# EAGLE design maxTouch-EXT V1 (EAGLE 9.5.2)
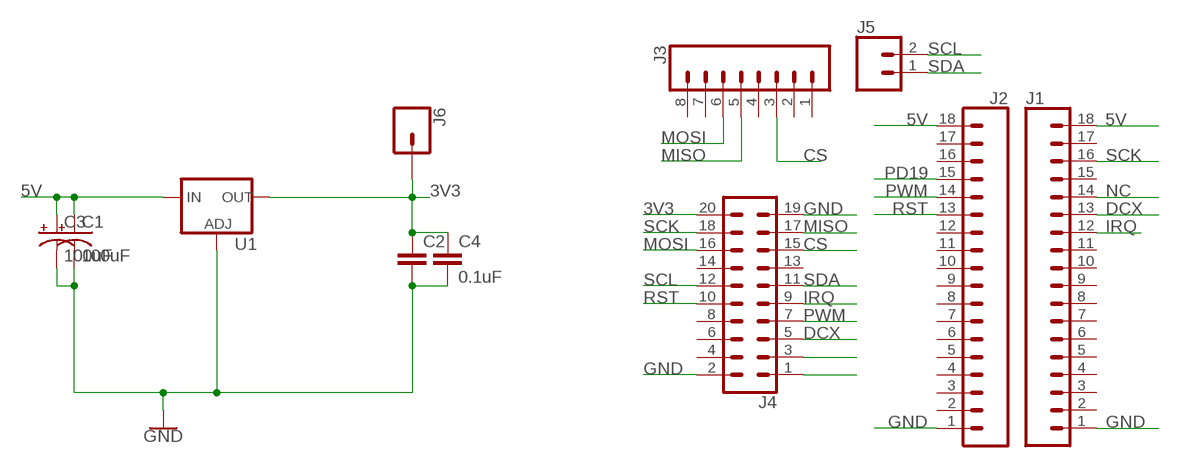
[diagram p0: schematic, sheet 1]

## Parts
C1  100uF  100UF-POLAR-10X10.5-63V-20%  [NIC_10X10.5_CAP]
C2  10uF  CAP-0805  [0805]
C3  100uF  100UF-POLAR-RADIAL-2.5MM-25V-20%  [CPOL-RADIAL-2.5MM-6.5MM]
C4  0.1uF  0.1UF-KIT-EZ-50V-20%  [CAP-PTH-SMALL-KIT]
J1  CONN_18SILK  [1X18]
J2  CONN_18SILK  [1X18]
J3  CONN_08"  [1X08]
J4  CONN_10X2  [2X10]
J5  CONN_02  [1X02]
J6  CONN_01  [1X01]
U1  V_REG_LM1117SOT223  [SOT223]

## Nets
3V3: C2.1 C4.1 J4.20 J6.1 U1.2(OUT) U1.4(OUT)
5V: C1.+ C3.1(+) J1.18 J2.18 U1.3(IN)
CS: J3.3 J4.15
DCX: J1.13 J4.5
GND: C1.- C2.2 C3.2(-) C4.2 J1.1 J2.1 J4.2 J4.19 U1.1(ADJ)
IRQ: J1.12 J4.9
MISO: J3.5 J4.17
MOSI: J3.6 J4.16
N$13: J4.1
N$14: J4.3
NC: J1.14
PD19: J2.15
PWM: J2.14 J4.7
RST: J2.13 J4.10
SCK: J1.16 J4.18
SCL: J4.12 J5.2
SDA: J4.11 J5.1
Unconnected: J1.2 J1.3 J1.4 J1.5 J1.6 J1.7 J1.8 J1.9 J1.10 J1.11 J1.15 J1.17 J2.2 J2.3 J2.4 J2.5 J2.6 J2.7 J2.8 J2.9 J2.10 J2.11 J2.12 J2.16 J2.17 J3.1 J3.2 J3.4 J3.7 J3.8 J4.4 J4.6 J4.8 J4.13 J4.14

## Library data of the parts
C1 = SparkFun-Capacitors:100UF-POLAR: 100µF polarized capacitors A capacitor is a passive two-terminal electrical component used to store electrical energy temporarily in an electric field.; PROD_ID: CAP-08362
C2 = SparkFun-Capacitors:CAP
C3 = SparkFun-Capacitors:100UF-POLAR: 100µF polarized capacitors A capacitor is a passive two-terminal electrical component used to store electrical energy temporarily in an electric field.; PROD_ID: CAP-08439
C4 = SparkFun-Capacitors:0.1UF: 0.1µF ceramic capacitors A capacitor is a passive two-terminal electrical component used to store electrical energy temporarily in an electric field.; PROD_ID: CAP-08370
J1 J2 = SparkFun-Connectors:CONN_18: Multi connection point. Often used as Generic Header-pin footprint for 0.1 inch spaced/style header connections On any of the 0.1 inch spaced packages, you can populate with these: Break Away Headers - Straight <https://www.sparkfun.com/products/116> (PRT-00116) Break Away Male Headers - Right Angle <https://www.sparkfun.com/products/553> (PRT-00553) Female Headers <https://www.sparkfun.com/products/115> (PRT-00115) Break Away Headers - Machine Pin <https://www.sparkfun.com/products/117> (PRT-00117) Break Away Female Headers - Swiss Machine Pin <https://www.sparkfun.com/products/743> (PRT-00743) For SCREWTERMINALS and SPRING TERMINALS visit here: Screw Terimnals on SparkFun.com <https://www.sparkfun.com/search/results?term=Screw+Terminals> (5mm/3.5mm/2.54mm spacing) This device is also useful as a general connection point to wire up your design to another part of your project. Our various solder wires solder well into these plated through hole pads. Hook-Up Wire - Assortment (Stranded, 22 AWG) <https://www.sparkfun.com/products/11375> (PRT-11375) Hook-Up Wire - Assortment (Solid Core, 22 AWG) <https://www.sparkfun.com/products/11367> (PRT-11367) View the entire wire category on our website here <https://www.sparkfun.com/categories/141> Special notes: Molex polarized connector foot print use with SKU : PRT-08231 with associated crimp pins and housings. 1MM SMD Version SKU: PRT-10208 NOTES ON THE VARIANTS LOCK and LOCK_LONGPADS... This footprint was designed to help hold the alignment of a through-hole component (i.e. 6-pin header) while soldering it into place. You may notice that each hole has been shifted either up or down by 0.005 of an inch from it's more standard position (which is a perfectly straight line). This slight alteration caused the pins (the squares in the middle) to touch the edges of the holes. Because they are alternating, it causes a "brace" to hold the component in place. 0.005 has proven to be the perfect amount of "off-center" position when using our standard breakaway headers. Although looks a little odd when you look at the bare footprint, once you have a header in there, the alteration is very hard to notice. Also,if you push a header all the way into place, it is covered up entirely on the bottom side.
J3 = SparkFun-Connectors:CONN_08: Multi connection point. Often used as Generic Header-pin footprint for 0.1 inch spaced/style header connections On any of the 0.1 inch spaced packages, you can populate with these: Break Away Headers - Straight <https://www.sparkfun.com/products/116> (PRT-00116) Break Away Male Headers - Right Angle <https://www.sparkfun.com/products/553> (PRT-00553) Female Headers <https://www.sparkfun.com/products/115> (PRT-00115) Break Away Headers - Machine Pin <https://www.sparkfun.com/products/117> (PRT-00117) Break Away Female Headers - Swiss Machine Pin <https://www.sparkfun.com/products/743> (PRT-00743) Arduino Stackable Header - 8 Pin <https://www.sparkfun.com/products/9279> (PRT-09279) For SCREWTERMINALS and SPRING TERMINALS visit here: Screw Terimnals on SparkFun.com <https://www.sparkfun.com/search/results?term=Screw+Terminals> (5mm/3.5mm/2.54mm spacing) This device is also useful as a general connection point to wire up your design to another part of your project. Our various solder wires solder well into these plated through hole pads. Hook-Up Wire - Assortment (Stranded, 22 AWG) <https://www.sparkfun.com/products/11375> (PRT-11375) Hook-Up Wire - Assortment (Solid Core, 22 AWG) <https://www.sparkfun.com/products/11367> (PRT-11367) View the entire wire category on our website here <https://www.sparkfun.com/categories/141> Special notes: Molex polarized connector foot print use with SKU : PRT-08231 with associated crimp pins and housings. 1MM SMD Version SKU: PRT-10208 NOTES ON THE VARIANTS LOCK and LOCK_LONGPADS... This footprint was designed to help hold the alignment of a through-hole component (i.e. 6-pin header) while soldering it into place. You may notice that each hole has been shifted either up or down by 0.005 of an inch from it's more standard position (which is a perfectly straight line). This slight alteration caused the pins (the squares in the middle) to touch the edges of the holes. Because they are alternating, it causes a "brace" to hold the component in place. 0.005 has proven to be the perfect amount of "off-center" position when using our standard breakaway headers. Although looks a little odd when you look at the bare footprint, once you have a header in there, the alteration is very hard to notice. Also,if you push a header all the way into place, it is covered up entirely on the bottom side.; PROD_ID: CONN-08438
J4 = SparkFun-Connectors:CONN_10X2: Multi connection point. Often used as Generic Header-pin footprint for 0.1 inch spaced/style header connections On any of the 0.1 inch spaced packages, you can populate with these: Break Away Headers - Straight <https://www.sparkfun.com/products/116> (PRT-00116) Break Away Male Headers - Right Angle <https://www.sparkfun.com/products/553> (PRT-00553) Female Headers <https://www.sparkfun.com/products/115> (PRT-00115) Break Away Headers - Machine Pin <https://www.sparkfun.com/products/117> (PRT-00117) Break Away Female Headers - Swiss Machine Pin <https://www.sparkfun.com/products/743> (PRT-00743) Special note about the "SPECIAL" package: This was SPECIALLY designed to be used with our Graphic LCD Backpack. Be sure you want to use this! It is not only staggered on each line of header holes, but IT IS ALSO offset of the center point of the top and bottom lines by 5 mil. This causes the headers to lock into place on the "standard" footprint on the LCD screen. The extra squares on the tdocu layer are there simply to reference other pins (if you were to actually populate a longer header than ten long - this is what we do with the backpacks).
J5 = SparkFun-Connectors:CONN_02: Multi connection point. Often used as Generic Header-pin footprint for 0.1 inch spaced/style header connections On any of the 0.1 inch spaced packages, you can populate with these: Break Away Headers - Straight <https://www.sparkfun.com/products/116> (PRT-00116) Break Away Male Headers - Right Angle <https://www.sparkfun.com/products/553> (PRT-00553) Female Headers <https://www.sparkfun.com/products/115> (PRT-00115) Break Away Headers - Machine Pin <https://www.sparkfun.com/products/117> (PRT-00117) Break Away Female Headers - Swiss Machine Pin <https://www.sparkfun.com/products/743> (PRT-00743) For SCREWTERMINALS and SPRING TERMINALS visit here: Screw Terimnals on SparkFun.com <https://www.sparkfun.com/search/results?term=Screw+Terminals> (5mm/3.5mm/2.54mm spacing) This device is also useful as a general connection point to wire up your design to another part of your project. Our various solder wires solder well into these plated through hole pads. Hook-Up Wire - Assortment (Stranded, 22 AWG) <https://www.sparkfun.com/products/11375> (PRT-11375) Hook-Up Wire - Assortment (Solid Core, 22 AWG) <https://www.sparkfun.com/products/11367> (PRT-11367) View the entire wire category on our website here <https://www.sparkfun.com/categories/141> Special notes: Molex polarized connector foot print use with: PRT-08233 with associated crimp pins and housings. 2.54_SCREWTERM for use with PRT-10571. 3.5mm Screw Terminal footprints for PRT-08084 5mm Screw Terminal footprints for use with PRT-08432
J6 = SparkFun-Connectors:CONN_01: Single connection point. Often used as Generic Header-pin footprint for 0.1 inch spaced/style header connections On any of the 0.1 inch spaced packages, you can populate with these: Break Away Headers - Straight <https://www.sparkfun.com/products/116> (PRT-00116) Break Away Male Headers - Right Angle <https://www.sparkfun.com/products/553> (PRT-00553) Female Headers <https://www.sparkfun.com/products/115> (PRT-00115) Break Away Headers - Machine Pin <https://www.sparkfun.com/products/117> (PRT-00117) Break Away Female Headers - Swiss Machine Pin <https://www.sparkfun.com/products/743> (PRT-00743) This device is also useful as a general connection point to wire up your design to another part of your project. Our various solder wires solder well into these plated through hole pads. Hook-Up Wire - Assortment (Stranded, 22 AWG) <https://www.sparkfun.com/products/11375> (PRT-11375) Hook-Up Wire - Assortment (Solid Core, 22 AWG) <https://www.sparkfun.com/products/11367> (PRT-11367) View the entire wire category on our website here <https://www.sparkfun.com/categories/141> Special notes: SMTSO-256-ET is a "flush mount" nut for a 4-40 screw. We mostly use this on specialty testbeds; it is a nice way to connect hardware to your PCB at an adjustable hieght. Also note, the SNAP packages are for using a snappable style connector. We sell a baggie of snaps and they are also used on two LilyPad designs: Snap Assortment - 30 pack (male and female) <https://www.sparkfun.com/products/11347> (DEV-11347) LilyPad Arduino SimpleSnap <https://www.sparkfun.com/products/10941> (DEV-10941) LilyPad SimpleSnap Protoboard <https://www.sparkfun.com/products/10940> (DEV-10940)
U1 = SparkFun-IC-Power:V_REG_LM1117: Voltage Regulator LM1117 Standard adjustable voltage regulator but in SMD form. Spark Fun Electronics SKU : COM-00595; PROD_ID: VREG-08170

## Board
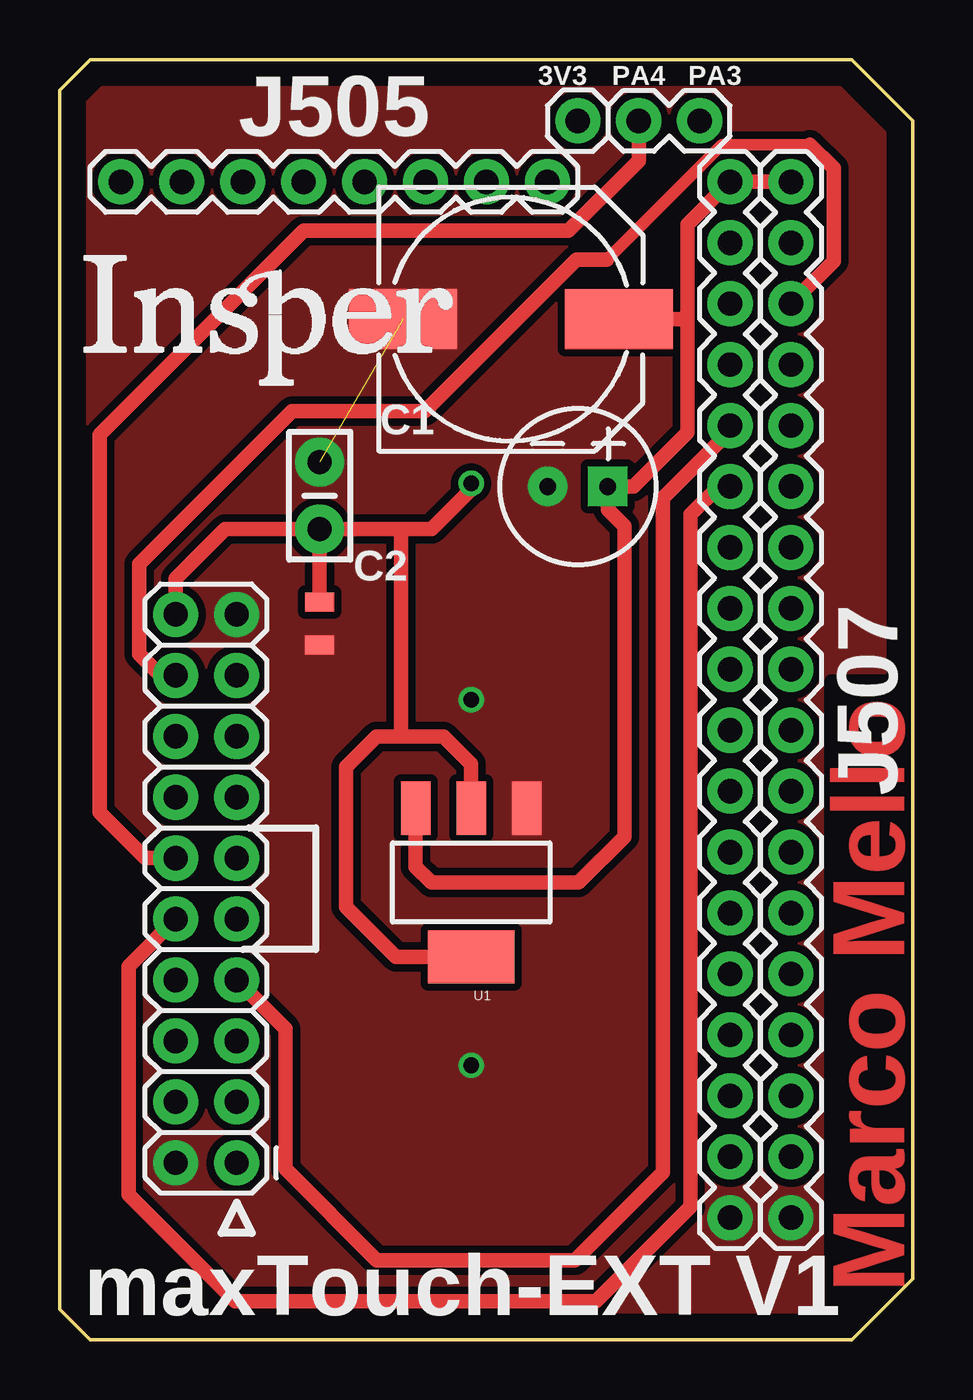
[diagram p1: board, top side]
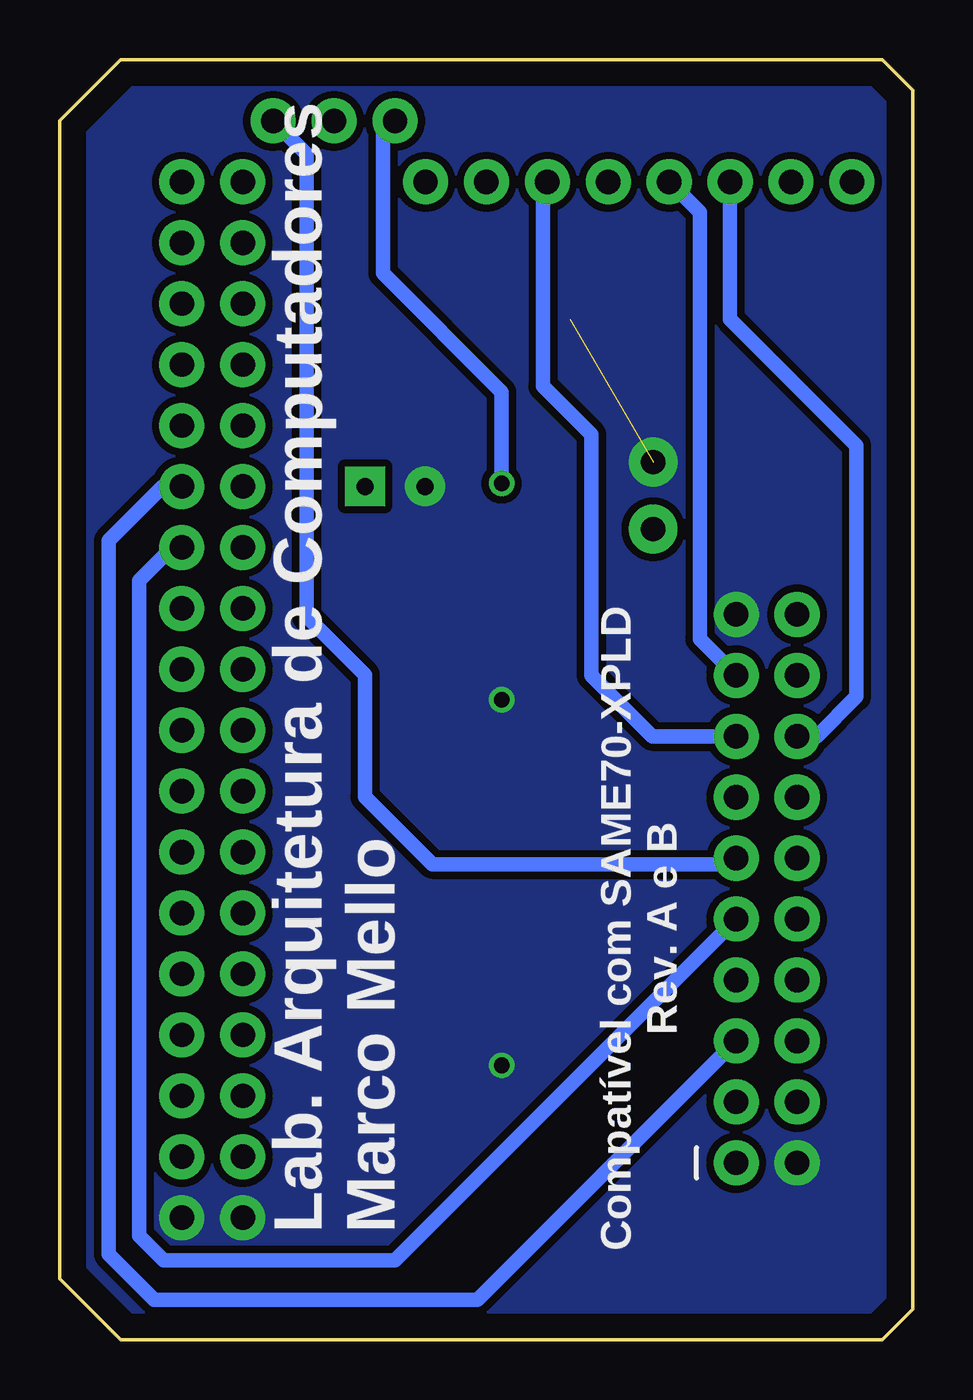
[diagram p2: board, bottom side, seen from below]

Size 35.56 x 53.34 mm. Coordinates in mm from the lower left corner, seen from the top.
Outline: 33.02,53.34 1.27,53.34 0,52.07 0,1.27 1.27,0 33.02,0 35.56,2.54 35.56,50.8 33.02,53.34
Copper layers (1*16): Top 0.035mm / dielectric 1.5mm / Bottom 0.035mm
Design rules "default": minimum track width 6mil, minimum drill 0.35mm, track to track 6mil, track to pad 6mil, pad to pad 6mil, via to via 6mil, smd to smd 6mil, copper to edge 40mil, drill to drill 6mil, minimum pad ring 10mil, minimum via ring 8mil, stop-mask expansion 4mil, vias tented up to drill 0mil, thermal gap 10mil

### Footprints (pad centres in the part's own frame; a part is rotated, then mirrored left to right if it is on the bottom)
NIC_10X10.5_CAP = smd 4.5 x 2.5: + 4.5,0; - -4.5,0
0805 = smd 0.8 x 1.2: 1 -0.9,0; 2 0.9,0
CPOL-RADIAL-2.5MM-6.5MM = drill 0.7 pad 1.651 square: 1 1.25,0 | drill 0.7 pad 1.651: 2 -1.25,0
CAP-PTH-SMALL-KIT = drill 1.016 pad 2.032: 1 -1.397,0; 2 1.397,0
1X18 = drill 1.016 pad 1.88: 1 0,0; 2 2.54,0; 3 5.08,0; 4 7.62,0; 5 10.16,0; 6 12.7,0; 7 15.24,0; 8 17.78,0; 9 20.32,0; 10 22.86,0; 11 25.4,0; 12 27.94,0; 13 30.48,0; 14 33.02,0; 15 35.56,0; 16 38.1,0; 17 40.64,0; 18 43.18,0
1X08 = drill 1.016 pad 1.88: 1 0,0; 2 2.54,0; 3 5.08,0; 4 7.62,0; 5 10.16,0; 6 12.7,0; 7 15.24,0; 8 17.78,0
2X10 = drill 1.016 pad 1.88: 1 0,0; 2 0,2.54; 3 2.54,0; 4 2.54,2.54; 5 5.08,0; 6 5.08,2.54; 7 7.62,0; 8 7.62,2.54; 9 10.16,0; 10 10.16,2.54; 11 12.7,0; 12 12.7,2.54; 13 15.24,0; 14 15.24,2.54; 15 17.78,0; 16 17.78,2.54; 17 20.32,0; 18 20.32,2.54; 19 22.86,0; 20 22.86,2.54
1X02 = drill 1.016 pad 1.88: 1 0,0; 2 2.54,0
1X01 = drill 1.016 pad 1.88: 1 0,0
SOT223 = smd 1.219 x 2.235: 1 -2.311,-3.099; 2 0,-3.099; 3 2.311,-3.099 | smd 3.6 x 2.2: 4 0,3.099

### Placement (x,y rotation side)
C1  18.8,42.55 0 top
C2  10.83,29.85 270 top
C3  21.59,35.56 0 top
C4  10.83,35.18 90 top
J1  30.48,5.08 90 top
J2  27.94,5.08 90 top
J3  20.32,48.26 180 top
J4  7.37,7.37 90 top
J5  26.67,50.8 180 top
J6  21.59,50.8 0 top
U1  17.14,19.05 180 top

### Tracks (layer width: path | path; a pad name or v marks a point on that pad's centre or on a via)
3V3  (via drill 0.65)
  Top 0.61: J4.20 4.83,31.72 6.89,33.78 C4.1 | C2.1 C4.1 | C4.1 14.22,33.78 | 14.22,33.78 15.49,33.78 17.14,35.43 v17.14,35.69 | U1.4 14.02,15.95 11.94,18.03 11.94,23.88 13.21,25.15 14.22,25.15 | U1.2 17.14,24 16,25.15 14.22,25.15 | 14.22,25.15 14.22,33.78
  Bottom 0.61: J6.1 22.1,50.29 22.1,44.45 17.14,39.5 v17.14,35.69
5V
  Top 0.6: J2.18 J1.18
  Top 0.61: J2.18 26.16,46.48 26.16,42.55 | 26.16,42.55 26.16,37.82 23.91,35.56 C3.1 22.84,34.59 23.53,33.91 23.53,20.96 21.62,19.05 15.49,19.05 14.83,19.71 U1.3 | C1.+ 26.16,42.55
CS
  Bottom 0.6: 13.4,27.68 10.86,25.15 J4.15 | J3.3 15.43,48.07 15.43,39.75
  Bottom 0.61: 15.43,39.75 13.4,37.72 13.4,27.68
DCX
  Bottom 0.61: J4.5 18.16,1.65 31.62,1.65 33.53,3.56 33.53,33.3 31.27,35.56 J1.13
GND  (via drill 0.65)  (1 unrouted)
  other vias: 17.14,26.67 17.14,11.43
  pour Bottom (isolate 0.305, no thermals): 0,1.27 1.27,0 33.02,0 35.56,2.54 35.56,50.8 33.02,53.34 1.27,53.34 0,52.07
  pour Top (isolate 0.305, no thermals): 0,1.27 1.27,0 33.02,0 35.56,2.54 35.56,50.8 33.02,53.34 1.27,53.34 0,52.07
IRQ
  Bottom 0.61: J1.12 30.89,33.02 32.26,31.65 32.26,4.32 31.24,3.3 21.59,3.3 J4.9
MISO
  Bottom 0.6: J4.17 8.89,29.21 8.89,46.99 J3.5
MOSI
  Bottom 0.6: J4.16 4,25.15 2.35,26.8 2.35,37.27 7.62,42.55 J3.6
PWM
  Top 0.61: J4.7 9.4,12.95 9.4,7.11 13.21,3.3 21.47,3.3 25.15,6.98 25.15,35.08 27.94,37.87 J2.14
RST
  Top 0.6: J4.10 2.86,15.56 2.86,6.03 7.3,1.59 22.35,1.59 26.29,5.52 26.29,30.76
  Top 0.61: J2.13 27.46,35.56 26.29,34.39 26.29,30.76
SCK
  Top 0.483: 22.74,44.96 22.8,45.02 27.59,49.81 31.27,49.81
  Top 0.61: J1.16 32.26,44.96 32.26,48.82 31.27,49.81 | J4.18 4.19,27.69 3.3,28.57 3.3,32.33 9.68,38.71 15.21,38.71 21.52,45.02 22.8,45.02
SCL
  Top 0.61: J4.12 3.56,20.07 1.65,21.97 1.65,37.72 10.16,46.23 21.21,46.23 24.13,49.15 J5.2
SDA
  Bottom 0.6: J4.11 7.62,19.81 20.03,19.81 22.84,22.62 22.84,27.7
  Bottom 0.61: J5.1 25.27,49.4 25.27,30.13 22.84,27.7

### Text on the board
Top: Marco Mello
tPlace: 3V3 | PA4 | PA3 | J505 | J507 | maxTouch-EXT V1
bPlace: Compatível com SAME70-XPLD / Rev. A e B | Lab. Arquitetura de Computadores / Marco Mello